# Altium project ClimaticDisplay_2_66_G.PrjPcb
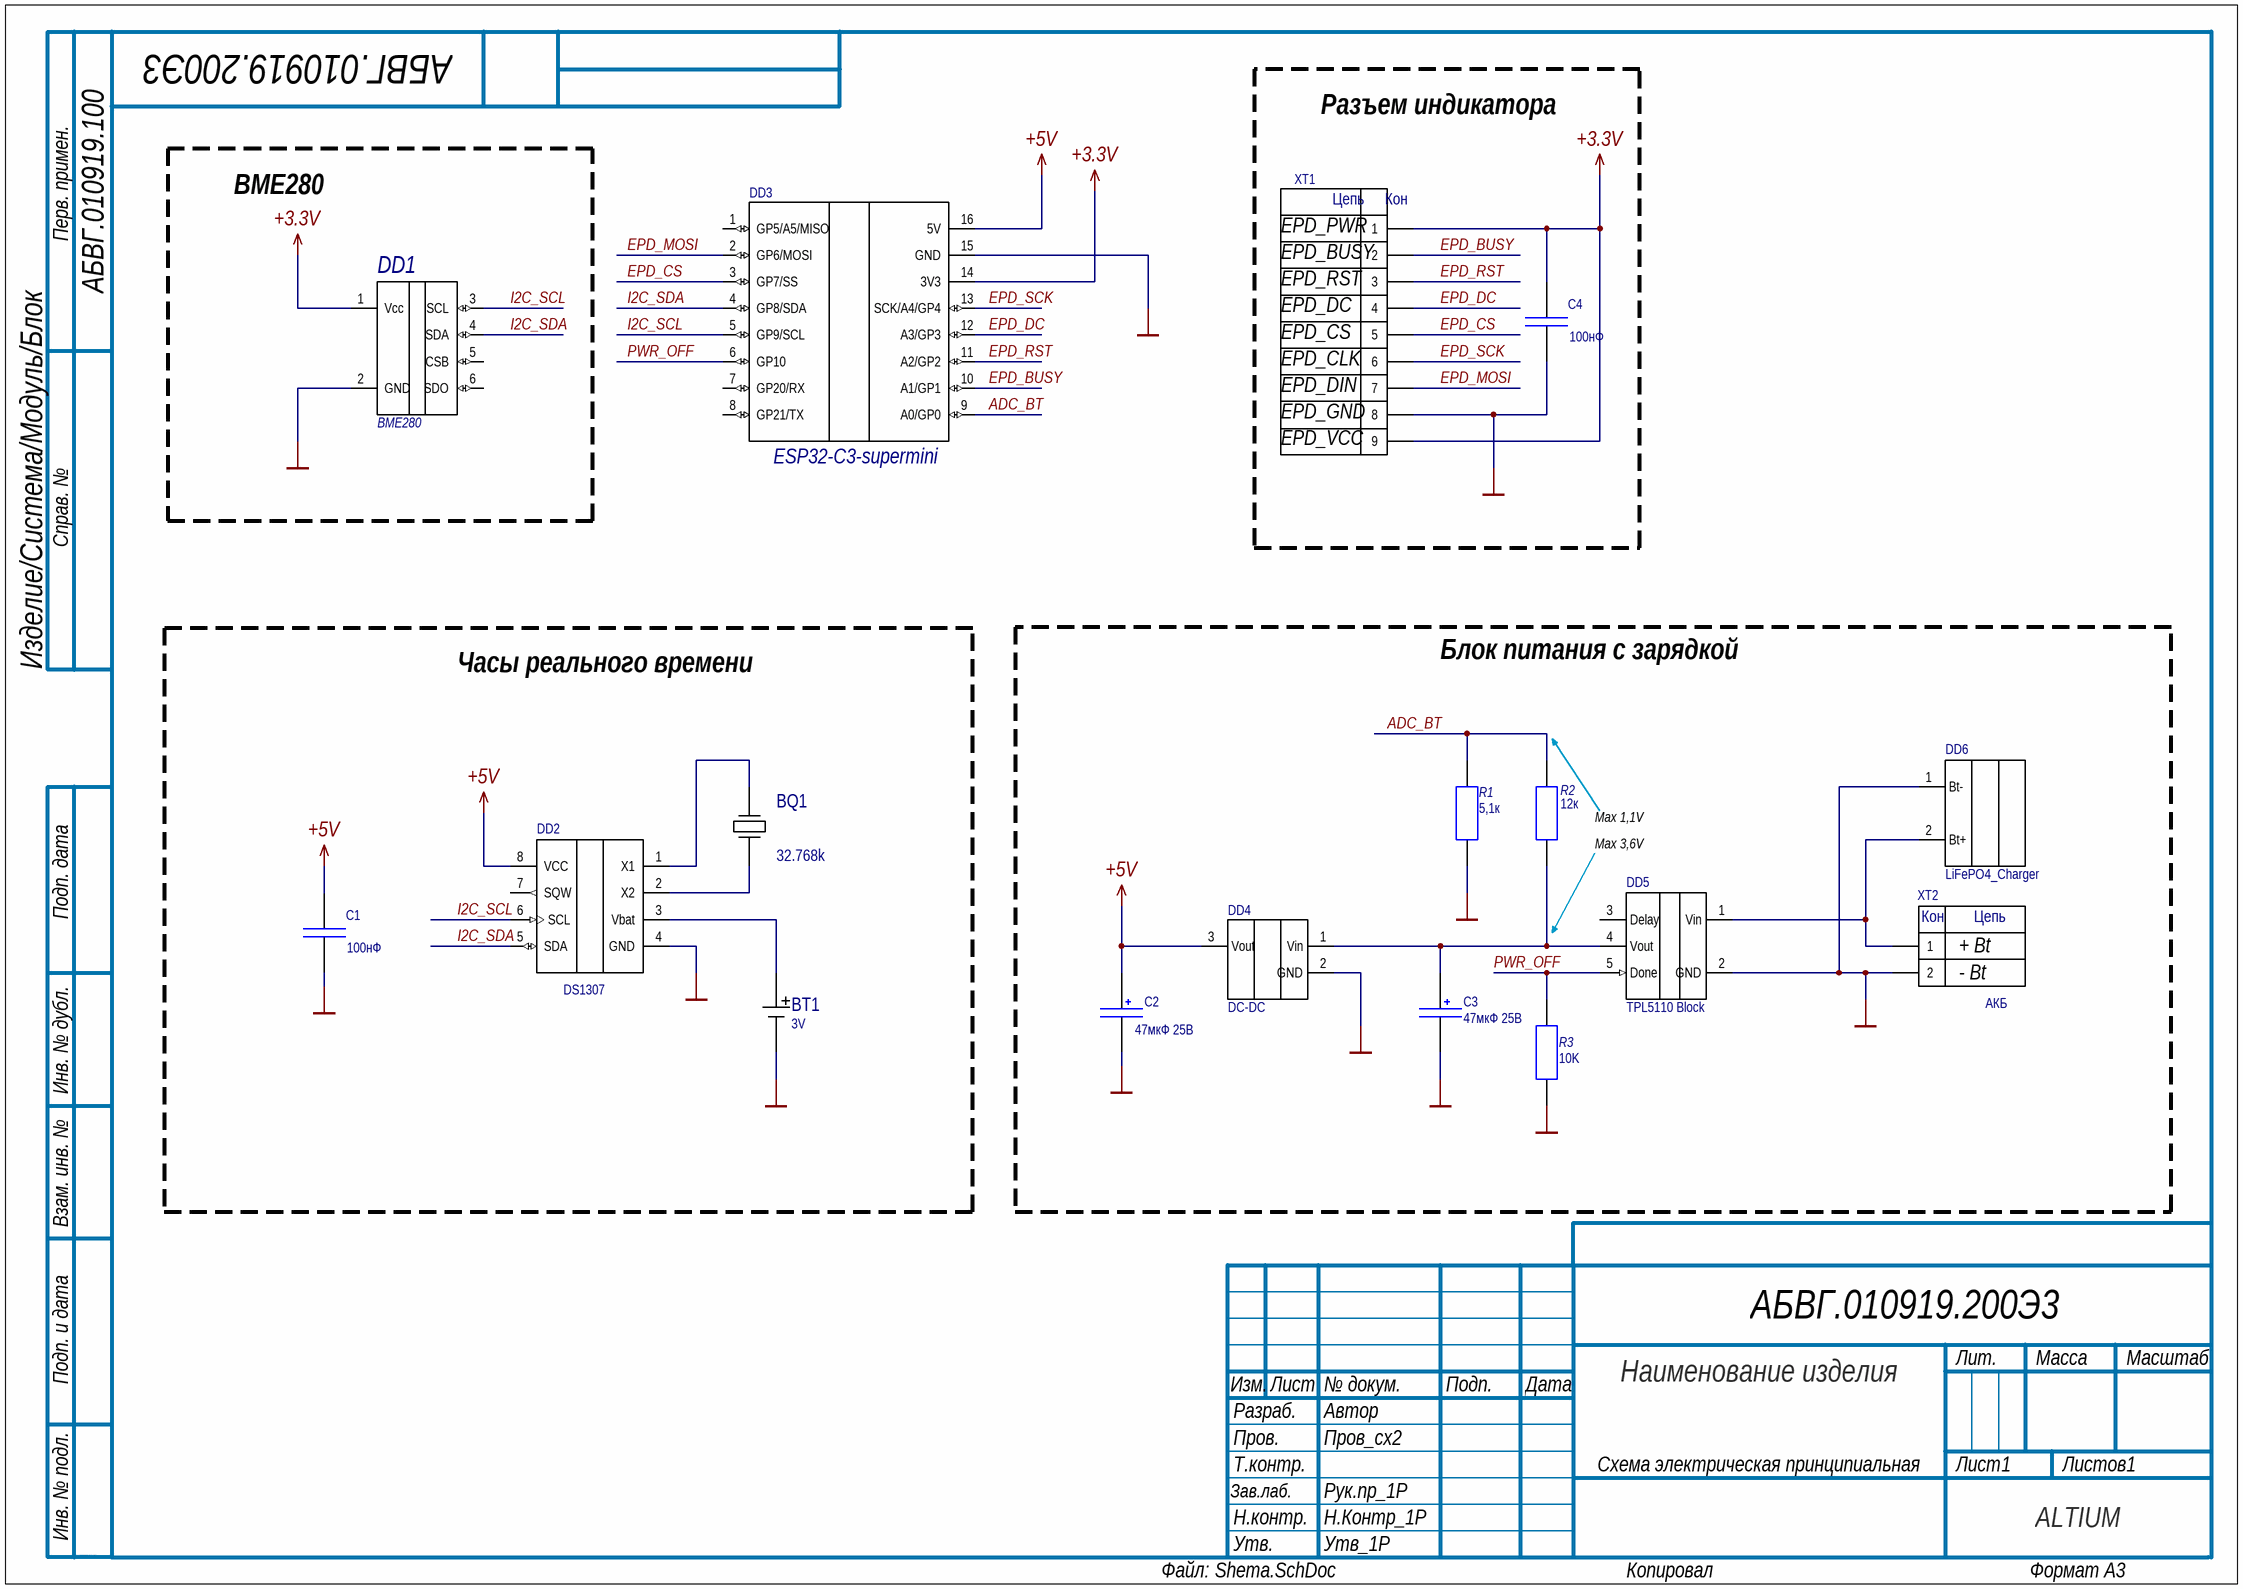
[diagram p0: Shema.SchDoc]
2_DocumentDesignation: ТЕСТ НОМЕРА; Взам.инв№: {№взамен}; Вид_документа: Файл проекта печатной платы; Вид_документа_PCB: Файл печатной платы; Вид_документа_SCH: Схема электрическая принципиальная; Инв.№дубл.: {№дубликата}; Инв.№подл.: {№подлиника}; Код_документа: Т6М; Код_документа_PCB: Т5М; Код_документа_SCH: Э3; Наименование: Наименование изделия; Наименование1: Наименование изделия; Наименование_PCB: Плата печатная; Наименование_организации: ALTIUM; Обозначение: АБВГ.010919.200; Обозначение_PCB: АБВГ.010919.010; Обозначение_SCH: АБВГ.010919.200; Обозначение_Код: АБВГ.010919.200Э3; Перв.Примен.: АБВГ.010919.100; ПервПримен: АБВГ.010919.100; Проект: Изделие/Система/Модуль/Блок; Раздел: Документация; Раздел_PCB: Документация; Раздел_SCH: Документация; Справочный.номер_SCH: {Справочный номер}; Характер_работы: Зав.лаб.; п_Доп_графа: Рук.пр_К2; п_Доп_графа_Р: Рук.пр_1Р; п_Н_контр: Н.Контр_К2; п_Н_контр_Р: Н.Контр_1Р; п_Пров: Пров_топ1; п_Пров_Р: Пров_сх2; п_Разраб: Разраб_топ1; п_Разраб_Р: Автор; п_Т_Контр: Т.Контр_К1; п_Утв: Утв_К1; п_Утв_Р: Утв_1Р
1 sheet, 17 parts. Net scope: global (net labels, ports and power ports of the same name join across sheets).
Board file: Plate.PcbDoc

## Sheet Shema.SchDoc
size 420 x 297 mm; Author: ALTIUM GOSTBOM2.0 KEV; SheetNumber: 1; SheetTotal: 1

### Parts
BQ1  32.768k  [XTAL_2x6_SMD]
BT1  value 3V  [CR1220]  (hidden comment: CR1220)
C1  value 100нФ  [Cap_0805]  (hidden comment: Capacitor)
C2  value 47мкФ 25В  [Tantal 2917_7343]  (hidden comment: Capacitor_Polar)
C3  value 47мкФ 25В  [Tantal 2917_7343]  (hidden comment: Capacitor_Polar)
C4  value 100нФ  [Cap_0805]  (hidden comment: Capacitor)
DD1  Name: BME280  [BME280_6Pin_1]  (hidden comment: Обозначение при заказе)
DD2  DS1307  [8S1_M]
DD3  ESP32-c3-supermini  [ESP32-C3 supermini_SMD]
DD4  Name: DC-DC  [DC-DC_0.9-5V]  (hidden comment: DC-DC_0.9-5V)
DD5  Name: TPL5110 Block  [TPL5110 Module]  (hidden comment: TPL5110 Module)
DD6  LiFePO4_Charger  [LiFePO4_Charger]
R1  value 5,1к  [Res_0805]  (hidden comment: Resistor)
R2  value 12к  [Res_0805]  (hidden comment: Resistor)
R3  value 10K  [Res_0805]  (hidden comment: Resistor)
XT1  Header 1X9  [PLS-9R-U1]  (value not drawn)
XT2  value АКБ  [PIN_1X2_5.08_DIP]  (hidden comment: Header 1x2)

### Blocks framed on the sheet
Разъем индикатора: C4 XT1
BME280: DD1
Часы реального времени: BQ1 BT1 C1 DD2
Блок питания с зарядкой: C2 C3 DD4-DD6 R1-R3 XT2

### Nets
+3.3V: C4.2 DD1.1(Vcc) DD3.14(3V3) XT1.1 XT1.9
+5V: C1.2 C2.1 DD2.8(VCC) DD3.16(5V) DD4.3(Vout)
GND: BT1.2(-) C1.1 C2.2 C3.2 C4.1 DD1.2(GND) DD2.4(GND) DD3.15(GND) DD4.2(GND) DD5.2(GND) DD6.1(Bt-) R1.2 R3.1 XT1.8 XT2.2
ADC_BT: DD3.9(A0/GP0) R1.1 R2.2
EPD_BUSY: DD3.10(A1/GP1) XT1.2
EPD_CS: DD3.3(GP7/SS) XT1.5
EPD_DC: DD3.12(A3/GP3) XT1.4
EPD_MOSI: DD3.2(GP6/MOSI) XT1.7
EPD_RST: DD3.11(A2/GP2) XT1.3
EPD_SCK: DD3.13(SCK/A4/GP4) XT1.6
I2C_SCL: DD1.3(SCL) DD2.6(SCL) DD3.5(GP9/SCL)
I2C_SDA: DD1.4(SDA) DD2.5(SDA) DD3.4(GP8/SDA)
PWR_OFF: DD3.6(GP10) DD5.5(Done) R3.2
NetBQ1_1: BQ1.1(OSC1) DD2.2(X2)
NetBQ1_2: BQ1.2(OSC2) DD2.1(X1)
NetBT1_1: BT1.1(+) DD2.3(Vbat)
NetC3_1: C3.1 DD4.1(Vin) DD5.4(Vout) R2.1
NetDD5_1: DD5.1(Vin) DD6.2(Bt+) XT2.1

Not connected (* = marked no-connect by the designer): DD1 5(CSB) 6(SDO); DD2 7(SQW); DD3 1(GP5/A5/MISO) 7(GP20/RX) 8(GP21/TX); DD5 3(Delay)

### Notes on the sheet
- (near XT1) EPD_BUSY
- (near XT1) EPD_PWR
- (near XT1) EPD_DC
- (near XT1) EPD_RST
- (near XT1) EPD_CS
- (near XT1) EPD_CLK
- (near XT1) EPD_DIN
- (near XT1) EPD_GND
- (near XT1) EPD_VCC
- Max 3,6V
- (near R2) Max 1,1V
- (near XT2) + Bt
- (near XT2) - Bt
- Перв. примен.
- Справ. №
- Подп. дата
- Инв. № дубл.
- Взам. инв. №
- Подп. и дата
- Изм.
- Разраб.
- Лист
- № докум.
- Подп.
- Дата
- Лит.
- Масса
- Масштаб
- Пров.
- Т.контр.
- Листов
- Инв. № подл.
- Н.контр.
- Утв.
- ALTIUM GOSTBOM2.0 KEV
- Файл:
- Копировал
- Формат А3
- (in symbol Header 1x2) Кон; Цепь
- (in symbol Header 1X9) Цепь; Кон

### Library data of the parts
BQ1 = XTAL-0003: Кварцевый резонатор 32768 Гц (часовой); Manufacturer: Китай; Box: A_25; Note: Общий запас с XTAL-0001; Package: DIP; ID: XTAL-0003; Stock: 0; Status: active
BT1 = MEC-0001: Держатель батарейки CR1220; Manufacturer: Китай; Name: держатель для CR2032; ID: MEC-0001; Stock: 0; Status: active
C1 C4 = Capacitor: Конденсатор; Package: 0805
C2 C3 = Capacitor_Polar: Конденсатор эл-лит; Package: DIP
DD1 = BME280_6Pin: Описание свойств компонента
DD2 = DS1307: Serial Clock; Package: 8S1; Name: DS1307
DD4 = DC-DC_0.9-5V: DC-DC Converter; Package: DIP
DD5 = TPL5110 Module: DC-DC Converter; Package: DIP
DD6 = LiFePO4_Charger: DC-DC Converter; Package: DIP; Name: LiFePO4_Charger
R1-R3 = Resistor: Резистор; Package: 0805
XT1 = Header 1X9: Name: Штыри на плату; Package: PLD2x8
XT2 = Header 1x2: Header 1x3; Name: Jamper
DD3 = ESP32-c3-supermini: Value: ESP32-C3-supermini